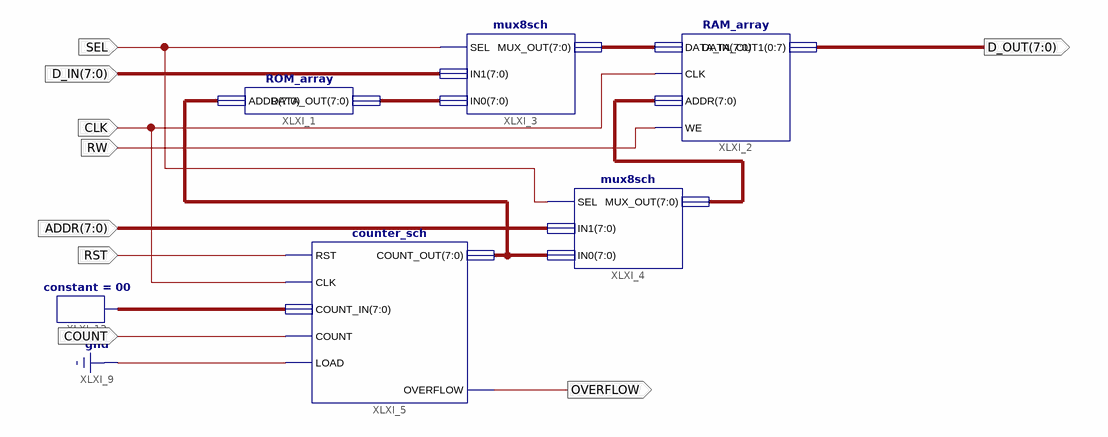
[diagram p0: schematic sheet 1]
// Xilinx ISE schematic mem_bootstrap_sch.sch (spartan3e) as structural Verilog: 6 symbols, 9 ports
module mem_bootstrap_sch (
  input  SEL,
  input  CLK,
  input  RW,
  input  RST,
  input  [7:0] D_IN,
  input  [7:0] ADDR,
  input  COUNT,
  output [7:0] D_OUT,
  output OVERFLOW
);

  wire [7:0] XLXN_1, XLXN_2, XLXN_10, XLXN_21, XLXN_30;

  RAM_array XLXI_2 (.ADDR(XLXN_10), .DATA_IN(XLXN_2), .WE(RW), .CLK(CLK), .DATA_OUT1(D_OUT));
  mux8sch XLXI_3 (.SEL(SEL), .IN1(D_IN), .IN0(XLXN_1), .MUX_OUT(XLXN_2));
  ROM_array XLXI_1 (.ADDR(XLXN_30), .DATA_OUT(XLXN_1));
  mux8sch XLXI_4 (.SEL(SEL), .IN1(ADDR), .IN0(XLXN_30), .MUX_OUT(XLXN_10));
  counter_sch XLXI_5 (
    .RST(RST), .CLK(CLK), .COUNT_IN(XLXN_21), .COUNT(COUNT), .LOAD(1'b0), .COUNT_OUT(XLXN_30),
    .OVERFLOW(OVERFLOW));
  constant #(.CValue("00")) XLXI_12 (.O(XLXN_21));
endmodule
